# EAGLE design LINE (EAGLE 6.4)
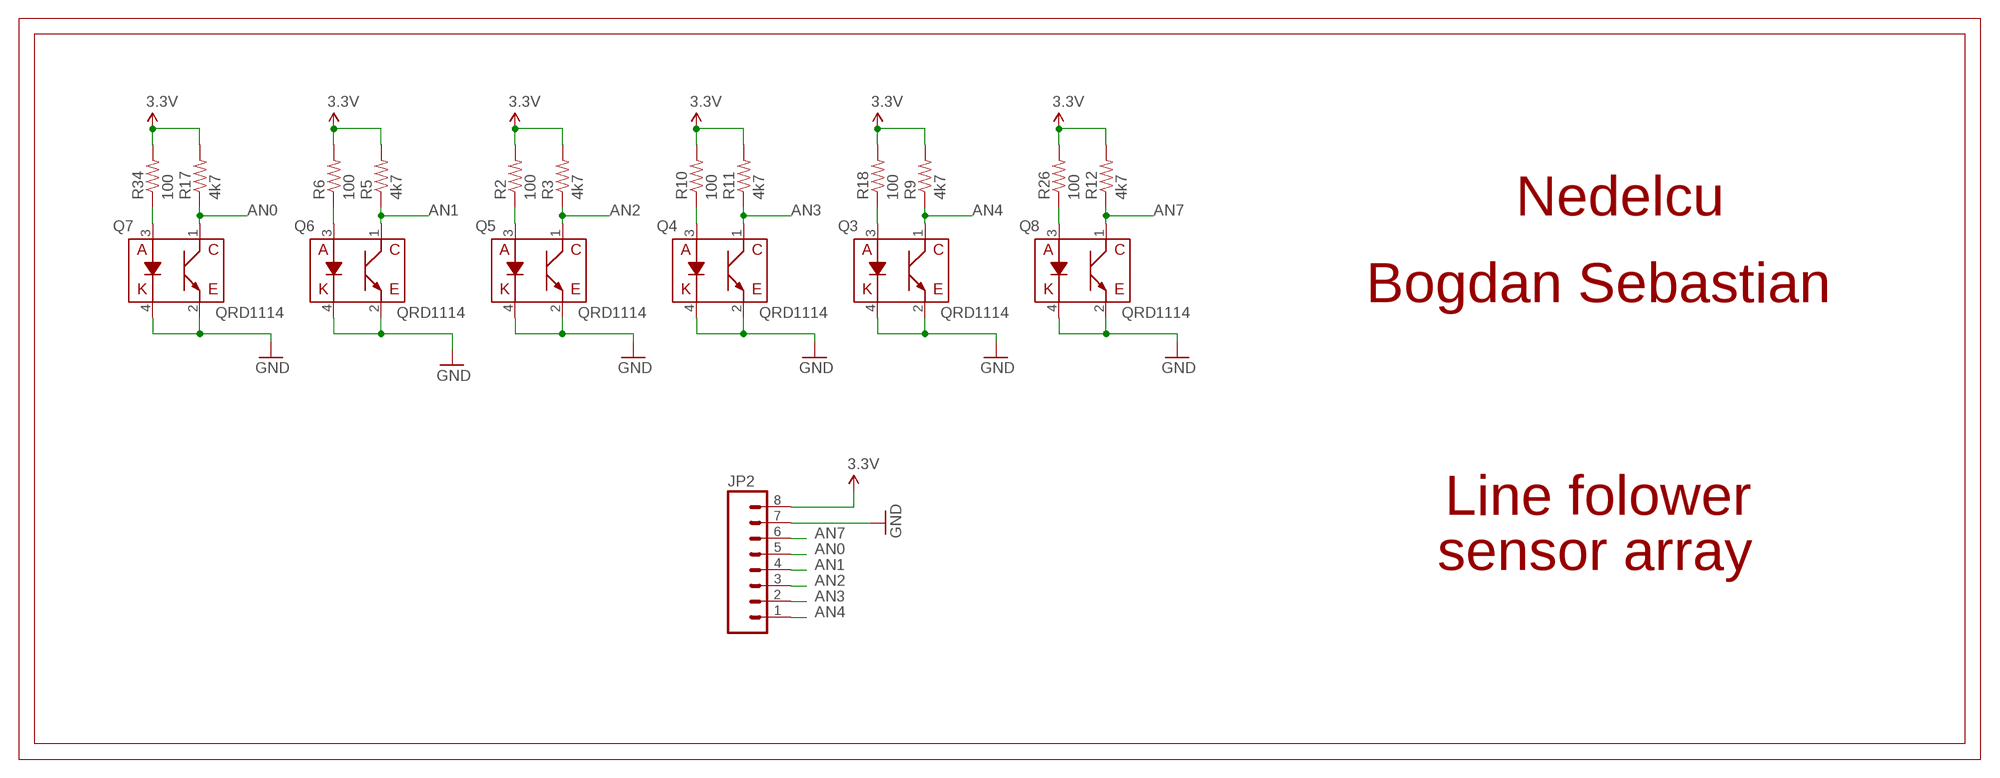
[diagram p0: schematic, sheet 1]

## Parts
JP2  M081X08  [1X08]
Q3  QRD1114  [QRD1114]
Q4  QRD1114  [QRD1114]
Q5  QRD1114  [QRD1114]
Q6  QRD1114  [QRD1114]
Q7  QRD1114  [QRD1114]
Q8  QRD1114  [QRD1114]
R2  100  RESISTOR0805-RES  [0805]
R3  4k7  RESISTOR0805-RES  [0805]
R5  4k7  RESISTOR0805-RES  [0805]
R6  100  RESISTOR0805-RES  [0805]
R9  4k7  RESISTOR0805-RES  [0805]
R10  100  RESISTOR0805-RES  [0805]
R11  4k7  RESISTOR0805-RES  [0805]
R12  4k7  RESISTOR0805-RES  [0805]
R17  4k7  RESISTOR0805-RES  [0805]
R18  100  RESISTOR0805-RES  [0805]
R26  100  RESISTOR0805-RES  [0805]
R34  100  RESISTOR0805-RES  [0805]

## Nets
3.3V: JP2.8 R2.2 R3.2 R5.2 R6.2 R9.2 R10.2 R11.2 R12.2 R17.2 R18.2 R26.2 R34.2
AN0: JP2.5 Q7.1(E) R17.1
AN1: JP2.4 Q6.1(E) R5.1
AN2: JP2.3 Q5.1(E) R3.1
AN3: JP2.2 Q4.1(E) R11.1
AN4: JP2.1 Q3.1(E) R9.1
AN7: JP2.6 Q8.1(E) R12.1
GND: JP2.7 Q3.2(C) Q3.4(K) Q4.2(C) Q4.4(K) Q5.2(C) Q5.4(K) Q6.2(C) Q6.4(K) Q7.2(C) Q7.4(K) Q8.2(C) Q8.4(K)
N$6: Q8.3(A) R26.1
N$7: Q7.3(A) R34.1
N$9: Q6.3(A) R6.1
N$12: Q5.3(A) R2.1
N$17: Q3.3(A) R18.1
N$20: Q4.3(A) R10.1

## Notes on the sheet
- Nedelcu
- Bogdan Sebastian
- Line folower
- sensor array

## Library data of the parts
JP2 = SparkFun-Connectors:M08: Header 8 Standard 8-pin 0.1" header. Use with straight break away headers (SKU : PRT-00116), right angle break away headers (PRT-00553), swiss pins (PRT-00743), machine pins (PRT-00117), and female headers (PRT-00115).
Q3-Q8 = SparkFun-Sensors:QRD1114: Reflective object sensor
R2 R3 R5 R6 R9-R12 R17 R18 R26 R34 = SparkFun-Passives:RESISTOR: Resistor Basic schematic elements and footprints for 0603, 1206, and PTH resistors.

## Board
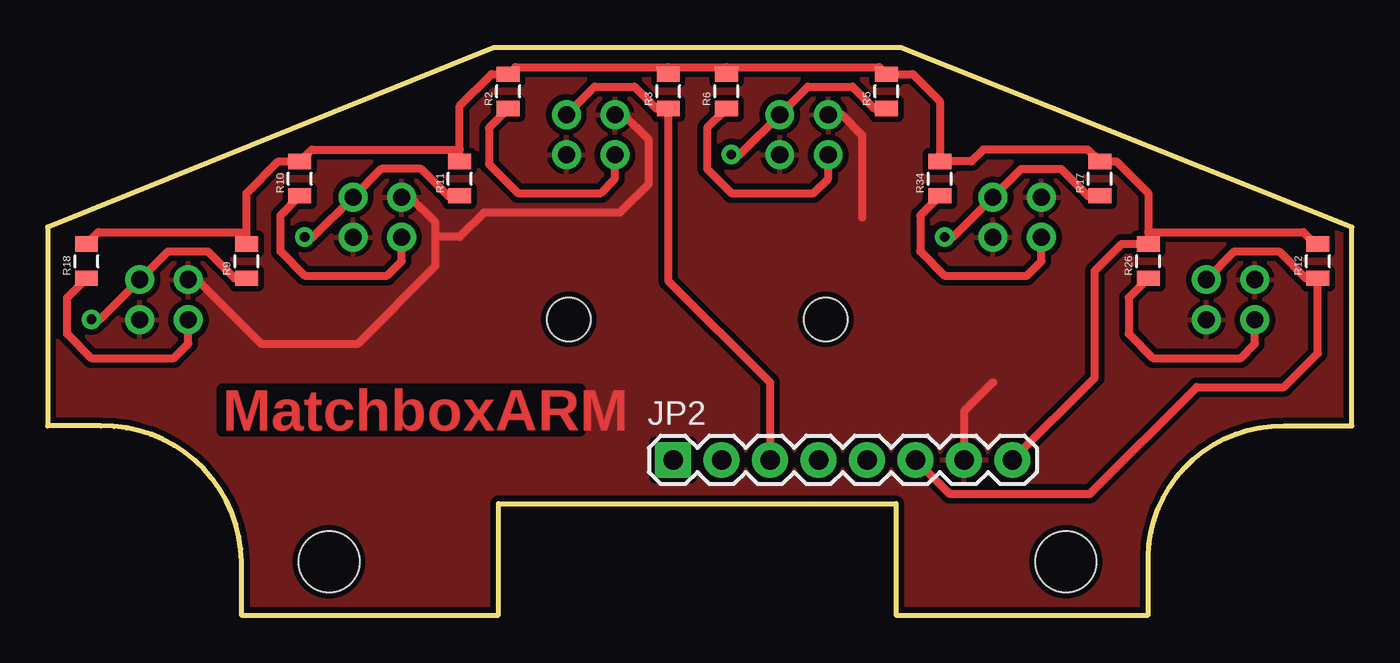
[diagram p1: board, top side]
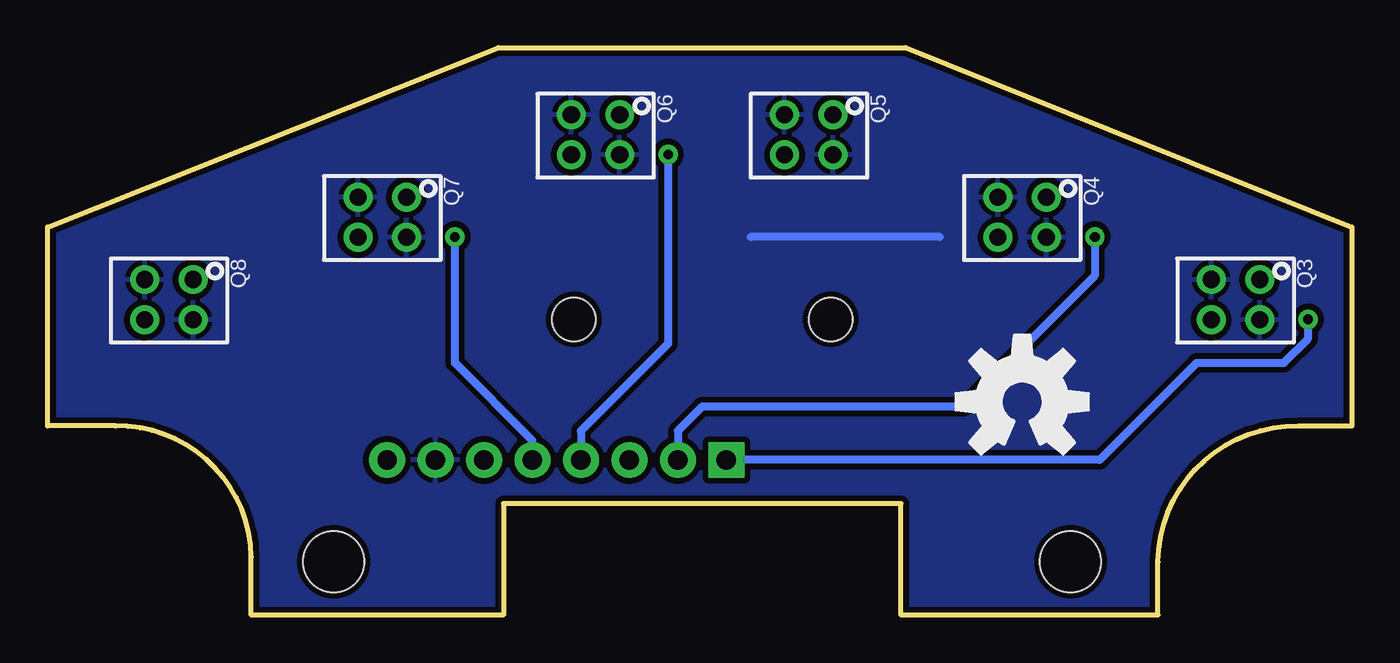
[diagram p2: board, bottom side, seen from below]

Size 68.33 x 29.72 mm. Coordinates in mm from the lower left corner, seen from the top.
Outline: 10.16,0 23.62,0 23.62,5.84 44.45,5.84 44.45,0 57.66,0 57.66,3.05 arc-90 64.77,9.91 68.33,9.91 68.33,20.32 44.7,29.72 23.37,29.72 0,20.32 0,9.91 2.79,9.91 arc-90 10.16,2.79 10.16,0
Copper layers (1*16): Top 0.035mm / dielectric 1.5mm / Bottom 0.035mm
Design rules "default *": minimum track width 8mil, minimum drill 20mil, track to track 8mil, track to pad 8mil, pad to pad 8mil, via to via 8mil, smd to smd 8mil, copper to edge 10mil, drill to drill 8mil, minimum pad ring 12mil, minimum via ring 10mil, stop-mask expansion 4mil, vias tented up to drill 25mil, thermal gap 10mil
Holes 3.2 mm at 14.73,2.79 53.34,2.79
Holes 2.29 mm at 27.3,15.49 40.77,15.49

### Footprints (pad centres in the part's own frame; a part is rotated, then mirrored left to right if it is on the bottom)
1X08 = drill 1.016 pad 1.88 square: 1 0,0 | drill 1.016 pad 1.88: 2 2.54,0; 3 5.08,0; 4 7.62,0; 5 10.16,0; 6 12.7,0; 7 15.24,0; 8 17.78,0
QRD1114 = drill 0.9: 1 -1.067,1.27; 2 -1.067,-1.27; 3 1.041,-1.27; 4 1.041,1.27
0805 = smd 0.8 x 1.2: 1 -0.9,0; 2 0.9,0

### Placement (x,y rotation side)
JP2  32.77,8.13 0 top
Q3  6.1,16.51 270 bottom
Q4  17.27,20.83 270 bottom
Q5  28.45,25.15 270 bottom
Q6  39.62,25.15 270 bottom
Q7  50.8,20.83 270 bottom
Q8  61.98,16.51 270 bottom
R2  24.13,27.43 90 top
R3  32.51,27.43 90 top
R5  43.94,27.43 90 top
R6  35.56,27.43 90 top
R9  10.41,18.54 90 top
R10  13.21,22.86 90 top
R11  21.59,22.86 90 top
R12  66.55,18.54 90 top
R17  55.12,22.86 90 top
R18  2.03,18.54 90 top
R26  57.66,18.54 90 top
R34  46.74,22.86 90 top
U$1  [CREATIVE_COMMONS]  5.33,-10.92 0 top  (outside the outline)
U$2  [OSHW-LOGO-L]  17.27,11.18 0 bottom

### Tracks (layer width: path | path; a pad name or v marks a point on that pad's centre or on a via)
3.3V
  Top 0.203: 46.48,23.88 R34.2 | 12.95,23.88 R10.2
  Top 0.406: R9.2 10.41,20.07 | 10.41,20.07 10.41,22.1 12.08,23.76 R10.2 13.83,24.38 21.59,24.38 | R11.2 21.59,24.38 | 21.59,24.38 21.59,26.67 23.25,28.33 R2.2 24.5,28.7 32.51,28.7 | 32.51,28.7 35.56,28.7 | 35.56,28.7 43.57,28.7 R5.2 45.33,28.33 46.74,26.92 R34.2 48.4,23.76 49.02,24.38 54.49,24.38 R17.2 56,23.76 57.66,22.1 57.66,20.07 | R3.2 32.51,28.7 | R6.2 35.56,28.7 | R18.2 2.66,20.07 10.41,20.07 | 57.66,20.07 R26.2 56.27,19.44 54.86,18.03 54.86,12.45 JP2.8 | 57.66,20.07 65.79,20.07 66.41,19.44 R12.2
AN0  (via drill 0.51)
  Top 0.406: R17.1 54.49,21.96 53.09,23.37 51,23.37 Q7.1 47.45,19.81 v46.99,19.81
  Bottom 0.406: JP2.5 42.93,9.14 46.99,13.21 v46.99,19.81
AN1  (via drill 0.51)
  Top 0.406: R5.1 43.32,26.53 42.16,27.69 39.83,27.69 Q6.1 36.27,24.13 v35.81,24.13
  Bottom 0.203: 38.35,26.16 Q6.1
  Bottom 0.406: JP2.4 40.39,9.65 35.81,14.22 v35.81,24.13
AN2
  Top 0.406: Q5.1 28.65,27.69 30.73,27.69 31.89,26.53 R3.1 32.51,17.53 37.85,12.19 JP2.3
AN3  (via drill 0.51)
  Top 0.406: R11.1 20.97,21.96 19.56,23.37 17.47,23.37 Q4.1 13.92,19.81 v13.46,19.81
  Bottom 0.203: 16,21.84 Q4.1
  Bottom 0.406: JP2.2 35.31,9.65 34.04,10.92 20.32,10.92 13.46,17.78 v13.46,19.81
AN4  (via drill 0.51)
  Top 0.406: R9.1 9.79,17.64 8.38,19.05 6.3,19.05 Q3.1 2.74,15.49 v2.29,15.49
  Bottom 0.406: JP2.1 13.21,8.13 8.13,13.21 3.56,13.21 2.29,14.48 v2.29,15.49
AN7
  Top 0.406: JP2.6 47.24,6.35 54.61,6.35 60.2,11.94 64.77,11.94 66.55,13.72 R12.1 65.92,17.64 64.52,19.05 62.18,19.05 Q8.1
GND
  Top 0.203: 38.35,24.13 Q6.4 | 49.53,19.81 Q7.4
  Top 0.406: Q3.2 7.82,17.58 11.18,14.22 16.26,14.22 20.32,18.29 20.32,19.81 | 20.32,19.81 20.32,20.57 19,21.89 Q4.2 | Q5.2 30.17,26.21 31.5,24.89 31.5,22.61 29.97,21.08 22.86,21.08 21.59,19.81 20.32,19.81 | Q6.4 38.33,24.11 | Q6.2 41.61,26.21 42.67,25.15 42.67,20.83 | 49.53,12.19 48.01,10.67 JP2.7
  Bottom 0.406: 21.59,19.81 31.5,19.81
  pour Bottom (isolate 0.305): 23.37,29.72 44.7,29.72 68.33,20.32 68.33,9.91 64.77,9.91 arc90 57.66,2.79 57.66,0 44.45,0 44.45,5.84 23.62,5.84 23.62,0 10.16,0 10.16,2.54 arc90 2.79,9.91 0,9.91 0,20.32
  pour Top (isolate 0.305): 0,20.32 23.37,29.72 44.7,29.72 68.33,20.32 68.33,9.91 64.77,9.91 arc90 57.66,2.79 57.66,0 44.45,0 44.45,5.84 23.62,5.84 23.62,0 10.16,0 10.16,2.79 arc90 3.05,9.91 0,9.91
N$1
  pour Top (isolate 0.61): 44.45,6.35 44.45,0 57.66,0 57.66,3.05 57.91,4.57 58.17,5.59 58.67,6.6
N$2
  pour Top (isolate 0.61): 55.12,6.86 60.2,11.94 64.77,11.94 66.55,13.72 66.55,13.21 68.33,13.21 68.33,9.91 64.01,9.91 62.74,9.65 61.98,9.4 60.96,8.89 60.2,8.38 59.18,7.37 58.67,6.6 58.17,5.59 57.91,4.83 57.66,3.3
N$6
  Top 0.406: Q8.3 63.25,14.22 62.51,13.46 57.91,13.46 56.64,14.73 56.64,16.63 R26.1
N$7
  Top 0.406: R34.1 45.72,20.94 45.72,19.05 46.99,17.78 51.31,17.78 52.07,18.54 Q7.3
N$9
  Top 0.406: Q6.3 40.89,22.86 40.13,22.1 35.81,22.1 34.54,23.37 34.54,25.52 R6.1
N$12
  Top 0.406: Q5.3 29.72,22.86 28.98,22.1 24.64,22.1 23.11,23.62 23.11,25.52 R2.1
N$17
  Top 0.406: Q3.3 7.37,14.22 6.6,13.46 2.29,13.46 1.02,14.73 1.02,16.63 R18.1
N$20
  Top 0.406: Q4.3 18.54,18.54 17.78,17.78 13.46,17.78 12.19,19.05 12.19,20.94 R10.1

### Text on the board
Top: MatchboxARM
tValues: Nedelcu Bogdan Sebastian